# EAGLE design El-Fueradoro_Zuendbox_v2 (EAGLE 6.6.0)
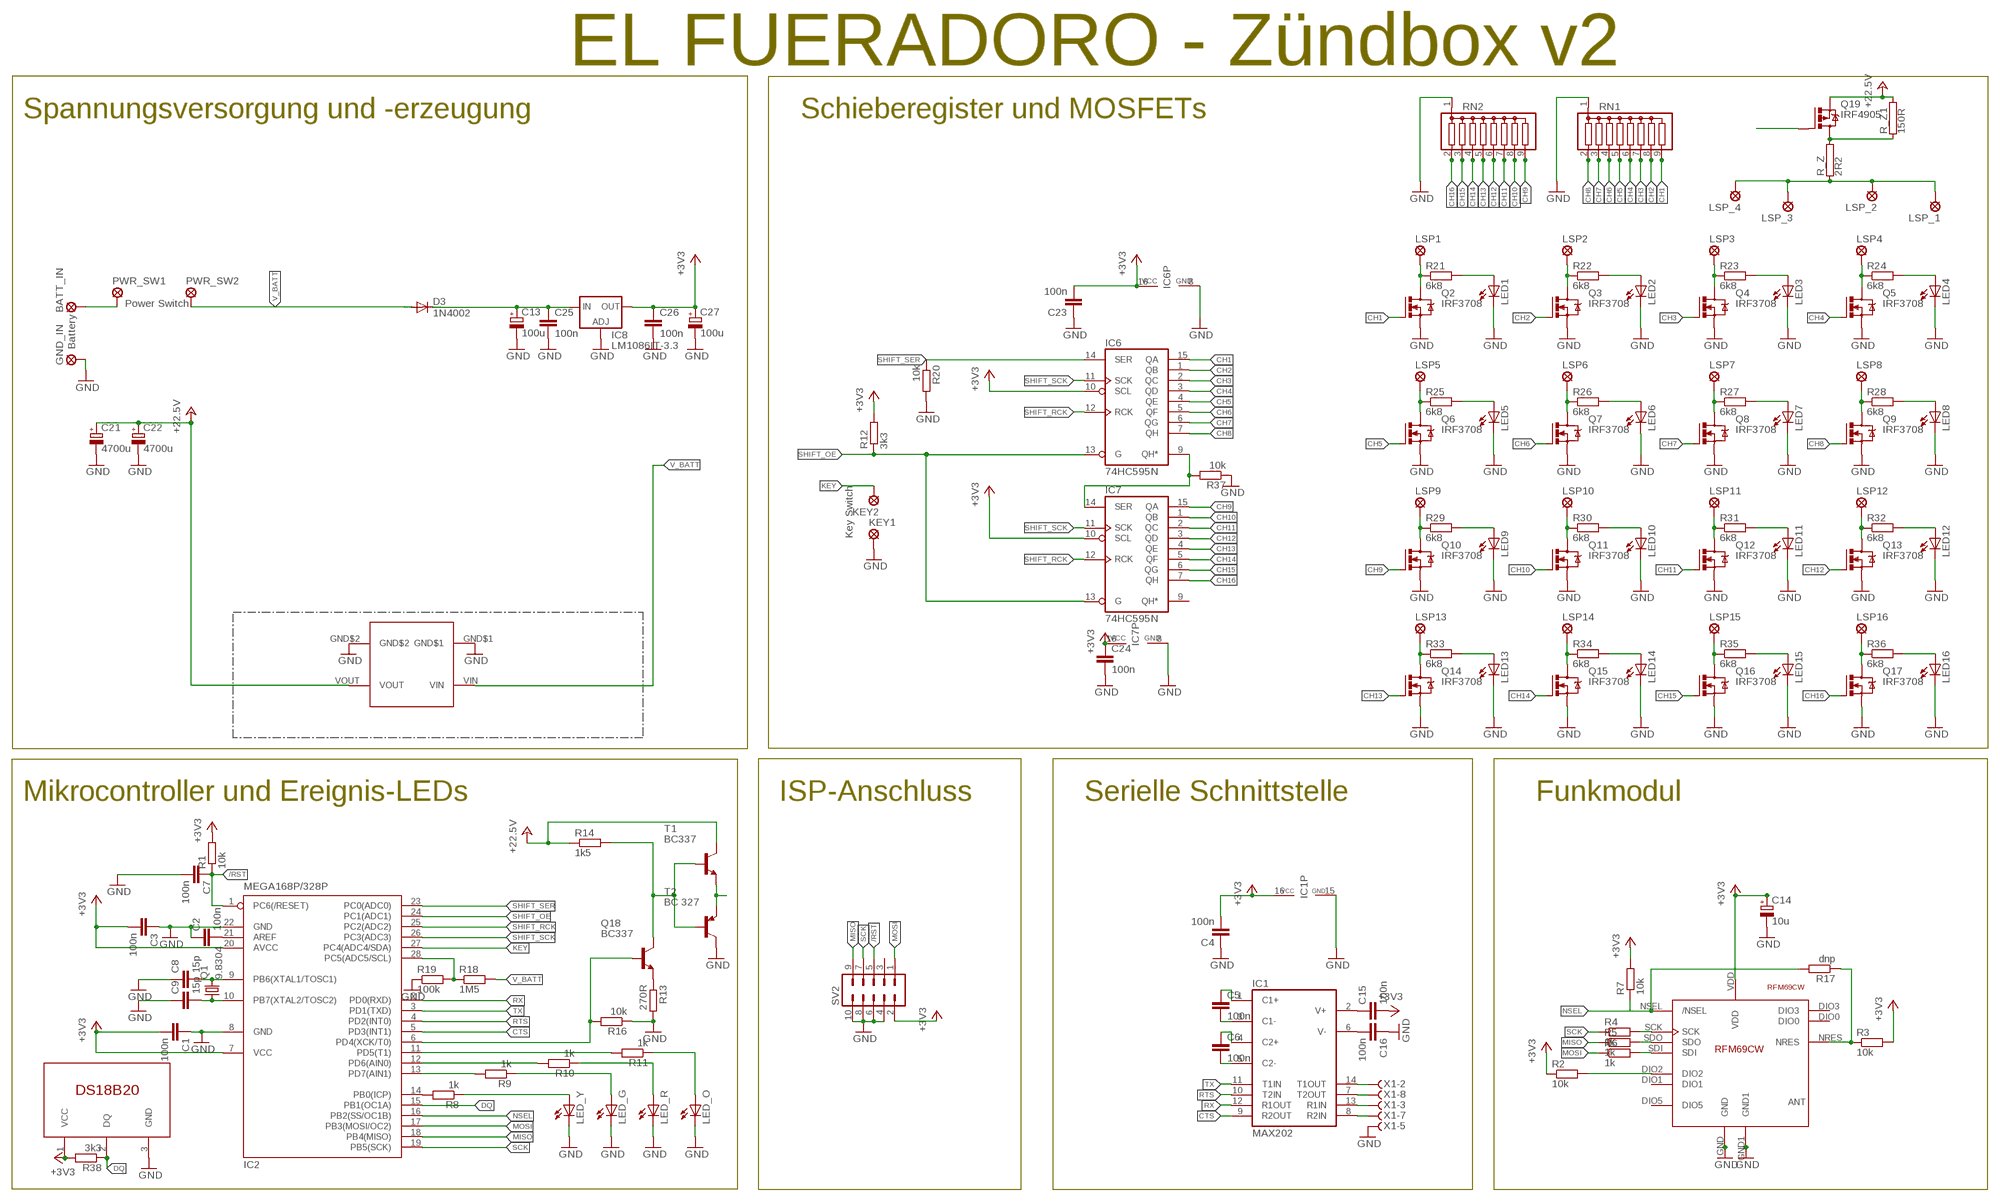
[diagram p0: schematic, sheet 1]

## Parts
BATT_IN  LSP10  [LSP10]
C1  100n  C-EU025-024X044  [C025-024X044]
C2  100n  C-EU025-024X044  [C025-024X044]
C3  100n  C-EU025-024X044  [C025-024X044]
C4  100n  C-EU025-024X044  [C025-024X044]
C5  100n  C-EU025-024X044  [C025-024X044]
C6  100n  C-EU025-024X044  [C025-024X044]
C7  100n  C-EU025-024X044  [C025-024X044]
C8  15p  C-EU025-024X044  [C025-024X044]
C9  15p  C-EU025-024X044  [C025-024X044]
C13  100u  CPOL-EUB45181A  [B45181A]
C14  10u  CPOL-EUB45181A  [B45181A]
C15  100n  C-EU025-024X044  [C025-024X044]
C16  100n  C-EU025-024X044  [C025-024X044]
C21  4700u  CPOL-EUE7.5-18  [E7,5-18]
C22  4700u  CPOL-EUE7.5-18  [E7,5-18]
C23  100n  C-EU025-024X044  [C025-024X044]
C24  100n  C-EU025-024X044  [C025-024X044]
C25  100n  C-EU025-024X044  [C025-024X044]
C26  100n  C-EU025-024X044  [C025-024X044]
C27  100u  CPOL-EUB45181A  [B45181A]
D3  1N4002  1N4004  [DO41-10]
GND_IN  LSP10  [LSP10]
IC1  MAX202  MAX232  [DIL16]
IC2  MEGA168P/328P  MEGA8-P  [DIL28-3]
IC6  74HC595N  [DIL16]
IC7  74HC595N  [DIL16]
IC8  LM1086IT-3.3  LD117AV  [TO220L1]
KEY1  LSP10  [LSP10]
KEY2  LSP10  [LSP10]
LED1  LED3MM  [LED3MM]
LED2  LED3MM  [LED3MM]
LED3  LED3MM  [LED3MM]
LED4  LED3MM  [LED3MM]
LED5  LED3MM  [LED3MM]
LED6  LED3MM  [LED3MM]
LED7  LED3MM  [LED3MM]
LED8  LED3MM  [LED3MM]
LED9  LED3MM  [LED3MM]
LED10  LED3MM  [LED3MM]
LED11  LED3MM  [LED3MM]
LED12  LED3MM  [LED3MM]
LED13  LED3MM  [LED3MM]
LED14  LED3MM  [LED3MM]
LED15  LED3MM  [LED3MM]
LED16  LED3MM  [LED3MM]
LED_G  LED5MM  [LED5MM]
LED_O  LED5MM  [LED5MM]
LED_R  LED5MM  [LED5MM]
LED_Y  LED5MM  [LED5MM]
LSP1  CH1  LSP11  [LSP11]
LSP2  CH2  LSP11  [LSP11]
LSP3  CH3  LSP11  [LSP11]
LSP4  CH4  LSP11  [LSP11]
LSP5  CH5  LSP11  [LSP11]
LSP6  CH6  LSP11  [LSP11]
LSP7  CH7  LSP11  [LSP11]
LSP8  CH8  LSP11  [LSP11]
LSP9  CH9  LSP11  [LSP11]
LSP10  CH10  LSP11  [LSP11]
LSP11  CH11  LSP11  [LSP11]
LSP12  CH12  LSP11  [LSP11]
LSP13  CH13  LSP11  [LSP11]
LSP14  CH14  LSP11  [LSP11]
LSP15  CH15  LSP11  [LSP11]
LSP16  CH16  LSP11  [LSP11]
LSP_1  LSP11  [LSP11]
LSP_2  LSP11  [LSP11]
LSP_3  LSP11  [LSP11]
LSP_4  LSP11  [LSP11]
PWR_SW1  LSP10  [LSP10]
PWR_SW2  LSP10  [LSP10]
Q1  9.8304  CRYSTALHC49S  [HC49/S]
Q2  IRF3708  IRF530  [TO220BV]
Q3  IRF3708  IRF530  [TO220BV]
Q4  IRF3708  IRF530  [TO220BV]
Q5  IRF3708  IRF530  [TO220BV]
Q6  IRF3708  IRF530  [TO220BV]
Q7  IRF3708  IRF530  [TO220BV]
Q8  IRF3708  IRF530  [TO220BV]
Q9  IRF3708  IRF530  [TO220BV]
Q10  IRF3708  IRF530  [TO220BV]
Q11  IRF3708  IRF530  [TO220BV]
Q12  IRF3708  IRF530  [TO220BV]
Q13  IRF3708  IRF530  [TO220BV]
Q14  IRF3708  IRF530  [TO220BV]
Q15  IRF3708  IRF530  [TO220BV]
Q16  IRF3708  IRF530  [TO220BV]
Q17  IRF3708  IRF530  [TO220BV]
Q18  BC337  BC337-40  [TO92]
Q19  IRF4905  IRF9530  [TO220BV]
R1  10k  R-EU_0207/10  [0207/10]
R2  10k  R-EU_0207/10  [0207/10]
R3  10k  R-EU_0207/10  [0207/10]
R4  1k  R-EU_0207/10  [0207/10]
R5  1k  R-EU_0207/10  [0207/10]
R6  1k  R-EU_0207/10  [0207/10]
R7  10k  R-EU_0207/10  [0207/10]
R8  1k  R-EU_0207/10  [0207/10]
R9  1k  R-EU_0207/10  [0207/10]
R10  1k  R-EU_0207/10  [0207/10]
R11  1k  R-EU_0207/10  [0207/10]
R12  3k3  R-EU_0207/10  [0207/10]
R13  270R  R-EU_0207/10  [0207/10]
R14  1k5  R-EU_0207/10  [0207/10]
R16  10k  R-EU_0207/10  [0207/10]
R17  dnp  R-EU_0207/10  [0207/10]
R18  1M5  R-EU_0207/10  [0207/10]
R19  100k  R-EU_0207/10  [0207/10]
R20  10k  R-EU_0207/10  [0207/10]
R21  6k8  R-EU_0207/10  [0207/10]
R22  6k8  R-EU_0207/10  [0207/10]
R23  6k8  R-EU_0207/10  [0207/10]
R24  6k8  R-EU_0207/10  [0207/10]
R25  6k8  R-EU_0207/10  [0207/10]
R26  6k8  R-EU_0207/10  [0207/10]
R27  6k8  R-EU_0207/10  [0207/10]
R28  6k8  R-EU_0207/10  [0207/10]
R29  6k8  R-EU_0207/10  [0207/10]
R30  6k8  R-EU_0207/10  [0207/10]
R31  6k8  R-EU_0207/10  [0207/10]
R32  6k8  R-EU_0207/10  [0207/10]
R33  6k8  R-EU_0207/10  [0207/10]
R34  6k8  R-EU_0207/10  [0207/10]
R35  6k8  R-EU_0207/10  [0207/10]
R36  6k8  R-EU_0207/10  [0207/10]
R37  10k  R-EU_0207/10  [0207/10]
R38  3k3  R-EU_0207/10  [0207/10]
R_Z  2R2  RKH214-8R  [KH214R-8]
R_Z1  150R  RKH214-8R  [KH214R-8]
RN1  G08R  [SIL9]
RN2  G08R  [SIL9]
SV2  ML10  [ML10]
T1  BC337  [TO92]
T2  BC 327  BC327  [TO92]
U$2  DS18B20  [TO92-LINE]
U$3  XL6009_MODULED  [XL6009_PACK]
U$4  RFM69CW  [RFM69CW]
X1  F09HPS  [F09HP]

## Nets
+3V3: C1.2 C3.2 C4.2 C14.+ C15.2 C23.2 C24.1 C26.1 C27.+ IC1.16(VCC) IC2.7(VCC) IC2.20(AVCC) IC6.10(SCL) IC6.16(VCC) IC7.10(SCL) IC7.16(VCC) IC8.2(OUT) R1.2 R2.1 R3.2 R7.2 R12.2 R38.2 SV2.2 U$2.1(VCC) U$4.VDD
+22_5V: C21.+ C22.+ Q19.S R14.1 R_Z1.2 T1.3(C) U$3.VOUT ; supply symbol labelled +22.5V
/RST: C7.1 IC2.1(PC6(/RESET)) R1.1 SV2.5
CH1: IC6.15(QA) Q2.G RN1.9
CH2: IC6.1(QB) Q3.G RN1.8
CH3: IC6.2(QC) Q4.G RN1.7
CH4: IC6.3(QD) Q5.G RN1.6
CH5: IC6.4(QE) Q6.G RN1.5
CH6: IC6.5(QF) Q7.G RN1.4
CH7: IC6.6(QG) Q8.G RN1.3
CH8: IC6.7(QH) Q9.G RN1.2
CH9: IC7.15(QA) Q10.G RN2.9
CH10: IC7.1(QB) Q11.G RN2.8
CH11: IC7.2(QC) Q12.G RN2.7
CH12: IC7.3(QD) Q13.G RN2.6
CH13: IC7.4(QE) Q14.G RN2.5
CH14: IC7.5(QF) Q15.G RN2.4
CH15: IC7.6(QG) Q16.G RN2.3
CH16: IC7.7(QH) Q17.G RN2.2
CTS: IC1.9(R2OUT) IC2.5(PD3(INT1))
DQ: IC2.15(PB1(OC1A)) R38.1 U$2.2(DQ)
DRVBASE: Q18.3(C) R14.2 T1.2(B) T2.2(B)
GND: C1.1 C2.1 C3.1 C4.1 C7.2 C8.1 C9.1 C13.- C14.- C16.1 C21.- C22.- C23.1 C24.2 C25.2 C26.2 C27.- GND_IN.MP IC1.15(GND) IC2.8(GND) IC2.22(GND) IC6.8(GND) IC7.8(GND) IC8.1(ADJ) KEY1.MP LED1.K(C) LED2.K(C) LED3.K(C) LED4.K(C) LED5.K(C) LED6.K(C) LED7.K(C) LED8.K(C) LED9.K(C) LED10.K(C) LED11.K(C) LED12.K(C) LED13.K(C) LED14.K(C) LED15.K(C) LED16.K(C) LED_G.K(C) LED_O.K(C) LED_R.K(C) LED_Y.K(C) Q2.S Q3.S Q4.S Q5.S Q6.S Q7.S Q8.S Q9.S Q10.S Q11.S Q12.S Q13.S Q14.S Q15.S Q16.S Q17.S R13.2 R16.1 R19.1 R20.2 R37.1 RN1.1 RN2.1 SV2.4 SV2.6 SV2.8 SV2.10 T2.3(C) U$2.3(GND) U$3.GND$1 U$3.GND$2 U$4.GND U$4.GND1 X1.5(-5:F)
KEY: IC2.27(PC4(ADC4/SDA)) KEY2.MP
MISO: IC2.18(PB4(MISO)) R5.1 SV2.9
MOSI: IC2.17(PB3(MOSI/OC2)) R6.1 SV2.1
N$1: BATT_IN.MP PWR_SW1.MP
N$2: C13.+ C25.1 D3.C IC8.3(IN)
N$3: IC2.6(PD4(XCK/T0)) Q18.2(B) R16.2
N$4: Q18.1(E) R13.1
N$7: LSP_1.MP LSP_2.MP LSP_3.MP LSP_4.MP R_Z.1
N$8: Q19.D R_Z1.1 R_Z.2
N$9: R2.2 U$4.DIO2
N$10: R4.2 U$4.SCK
N$11: R5.2 U$4.SDO
N$12: R6.2 U$4.SDI
N$13: R3.1 R17.1 U$4.NRES
N$17: C2.2 IC2.21(AREF)
N$18: C9.2 IC2.10(PB7(XTAL2/TOSC2)) Q1.1
N$19: C5.1 IC1.1(C1+)
N$20: C5.2 IC1.3(C1-)
N$21: C6.1 IC1.4(C2+)
N$22: C6.2 IC1.5(C2-)
N$23: C8.2 IC2.9(PB6(XTAL1/TOSC1)) Q1.2
N$27: IC2.13(PD7(AIN1)) R9.2
N$28: IC2.12(PD6(AIN0)) R10.2
N$29: IC2.11(PD5(T1)) R11.2
N$30: LED_O.A R11.1
N$31: IC2.14(PB0(ICP)) R8.2
N$32: LED_R.A R10.1
N$33: LED_G.A R9.1
N$34: LED_Y.A R8.1
N$37: IC2.28(PC5(ADC5/SCL)) R18.1 R19.2
N$43: C15.1 IC1.2(V+)
N$44: C16.2 IC1.6(V-)
N$51: IC6.9(QH*) IC7.14(SER) R37.2
N$52: LSP1.MP Q2.D R21.1
N$53: LSP2.MP Q3.D R22.1
N$54: LSP3.MP Q4.D R23.1
N$55: LSP4.MP Q5.D R24.1
N$56: LSP5.MP Q6.D R25.1
N$57: LSP6.MP Q7.D R26.1
N$58: LSP7.MP Q8.D R27.1
N$59: LSP8.MP Q9.D R28.1
N$60: LSP9.MP Q10.D R29.1
N$61: LSP10.MP Q11.D R30.1
N$62: LSP11.MP Q12.D R31.1
N$63: LSP12.MP Q13.D R32.1
N$64: LSP13.MP Q14.D R33.1
N$65: LSP14.MP Q15.D R34.1
N$66: LSP15.MP Q16.D R35.1
N$67: LSP16.MP Q17.D R36.1
N$72: LED1.A R21.2
N$73: LED2.A R22.2
N$74: LED3.A R23.2
N$75: LED4.A R24.2
N$76: LED5.A R25.2
N$77: LED6.A R26.2
N$78: LED7.A R27.2
N$79: LED8.A R28.2
N$80: LED9.A R29.2
N$81: LED10.A R30.2
N$82: LED11.A R31.2
N$83: LED12.A R32.2
N$84: LED13.A R33.2
N$85: LED14.A R34.2
N$86: LED15.A R35.2
N$87: LED16.A R36.2
NSEL: IC2.16(PB2(SS/OC1B)) R7.1 R17.2 U$4.NSEL(/NSEL)
PC_CTS_IN: IC1.7(T2OUT) X1.8(-8:F)
PC_RTS_OUT: IC1.8(R2IN) X1.7(-7:F)
PC_RX_IN: IC1.14(T1OUT) X1.2(-2:F)
PC_TX_OUT: IC1.13(R1IN) X1.3(-3:F)
PMOSG: Q19.G T1.1(E) T2.1(E)
RTS: IC1.10(T2IN) IC2.4(PD2(INT0))
RX: IC1.12(R1OUT) IC2.2(PD0(RXD))
SCK: IC2.19(PB5(SCK)) R4.1 SV2.7
SHIFT_OE: IC2.24(PC1(ADC1)) IC6.13(G) IC7.13(G) R12.1
SHIFT_RCK: IC2.25(PC2(ADC2)) IC6.12(RCK) IC7.12(RCK)
SHIFT_SCK: IC2.26(PC3(ADC3)) IC6.11(SCK) IC7.11(SCK)
SHIFT_SER: IC2.23(PC0(ADC0)) IC6.14(SER) R20.1
TX: IC1.11(T1IN) IC2.3(PD1(TXD))
V_BATT: D3.A PWR_SW2.MP R18.2 U$3.VIN
Unconnected: IC7.9(QH*) SV2.3 U$4.DIO0 U$4.DIO1 U$4.DIO3 U$4.DIO5 X1.1(-1:F) X1.4(-4:F) X1.6(-6:F) X1.9(-9:F) X1.G1(-G:G1) X1.G2(-G:G2)

## Notes on the sheet
- EL FUERADORO - Zündbox v2
- Spannungsversorgung und -erzeugung | Schieberegister und MOSFETs
- Power Switch
- Battery
- Key Switch
- Mikrocontroller und Ereignis-LEDs | ISP-Anschluss | Serielle Schnittstelle | Funkmodul

## Library data of the parts
BATT_IN GND_IN KEY1 KEY2 PWR_SW1 PWR_SW2 = solpad:LSP10: SOLDER PAD drill 1.0 mm, distributor Buerklin, 12H555
C1-C9 C15 C16 C23-C26 = rcl:C-EU: CAPACITOR, European symbol
C13 C14 C21 C22 C27 = rcl:CPOL-EU: POLARIZED CAPACITOR, European symbol
D3 = diode:1N4004: DIODE general purpose rectifier, 1 A
IC1 = maxim:MAX232: RS232 TRANSCEIVER; MF: MAXIM; MPN: MAX232ACPE+; OC_FARNELL: 9723773; OC_NEWARK: 68K4544
IC2 = atmel:MEGA8-P: MICROCONTROLLER 8 Kbytes FLASH, 1 kbytes SRAM, 512 bytes EEPROM, USART, 4-channel 10 bit ADC, 2-channel 8 bit ADC Pin compatible with Atmega48, ATMega88, ATMega168 Source: avr.lbr; OC_FARNELL: unknown; OC_NEWARK: unknown
IC6 IC7 = 74xx-eu:74*595: 8-bit SHIFT REGISTER, output latch
IC8 = v-reg:LD117A?*: Low drop fixed and adjustable positive voltage regulators 1 A Source: http://www.st.com/stonline/products/literature/ds/7194/ld1117axx.pdf
LED1-LED16 LED_G LED_O LED_R LED_Y = led:LED: LED OSRAM: - CHIPLED LG R971, LG N971, LY N971, LG Q971, LY Q971, LO R971, LY R971 LH N974, LH R974 LS Q976, LO Q976, LY Q976 LO Q996 - Hyper CHIPLED LW Q18S LB Q993, LB Q99A, LB R99A - SideLED LS A670, LO A670, LY A670, LG A670, LP A670 LB A673, LV A673, LT A673, LW A673 LH A674 LY A675 LS A676, LA A676, LO A676, LY A676, LW A676 LS A679, LY A679, LG A679 - Hyper Micro SIDELED® LS Y876, LA Y876, LO Y876, LY Y876 LT Y87S - SmartLED LW L88C, LW L88S LB L89C, LB L89S, LG L890 LS L89K, LO L89K, LY L89K LS L896, LA L896, LO L896, LY L896 - TOPLED LS T670, LO T670, LY T670, LG T670, LP T670 LSG T670, LSP T670, LSY T670, LOP T670, LYG T670 LG T671, LOG T671, LSG T671 LB T673, LV T673, LT T673, LW T673 LH T674 LS T676, LA T676, LO T676, LY T676, LB T676, LH T676, LSB T676, LW T676 LB T67C, LV T67C, LT T67C, LS T67K, LO T67K, LY T67K, LW E67C LS E67B, LA E67B, LO E67B, LY E67B, LB E67C, LV E67C, LT E67C LW T67C LS T679, LY T679, LG T679 LS T770, LO T770, LY T770, LG T770, LP T770 LB T773, LV T773, LT T773, LW T773 LH T774 LS E675, LA E675, LY E675, LS T675 LS T776, LA T776, LO T776, LY T776, LB T776 LHGB T686 LT T68C, LB T68C - Hyper Mini TOPLED® LB M676 - Mini TOPLED Santana® LG M470 LS M47K, LO M47K, LY M47K Source: http://www.osram.convergy.de LUXEON: - LUMILED® LXK2-PW12-R00, LXK2-PW12-S00, LXK2-PW14-U00, LXK2-PW14-V00 LXK2-PM12-R00, LXK2-PM12-S00, LXK2-PM14-U00 LXK2-PE12-Q00, LXK2-PE12-R00, LXK2-PE12-S00, LXK2-PE14-T00, LXK2-PE14-U00 LXK2-PB12-K00, LXK2-PB12-L00, LXK2-PB12-M00, LXK2-PB14-N00, LXK2-PB14-P00, LXK2-PB14-Q00 LXK2-PR12-L00, LXK2-PR12-M00, LXK2-PR14-Q00, LXK2-PR14-R00 LXK2-PD12-Q00, LXK2-PD12-R00, LXK2-PD12-S00 LXK2-PH12-R00, LXK2-PH12-S00 LXK2-PL12-P00, LXK2-PL12-Q00, LXK2-PL12-R00 Source: www.luxeon.com KINGBRIGHT: KA-3528ASYC Source: www.kingbright.com
LSP1-LSP16 LSP_1-LSP_4 = solpad:LSP11: SOLDER PAD drill 1.1 mm
Q1 = crystal:CRYSTAL: CRYSTAL; OC_FARNELL: 1667008; OC_NEWARK: unknown
Q2-Q17 = transistor-power:IRF530: HEXFET Power MOSFET
Q18 = transistor-npn:BC337*: NPN Transistor
Q19 = transistor-power:IRF9530: P-CHANNEL HEXFET POWER-MOS-FET Source: http://www.irf.com/product-info/datasheets/data/irf9530.pdf
R1-R14 R16-R38 = rcl:R-EU_: RESISTOR, European symbol
R_Z R_Z1 = resistor-power:R: Power Resitor; OC_FARNELL: unknown; OC_NEWARK: unknown
RN1 RN2 = resistor-sil:G08R: SIL RESISTOR; OC_FARNELL: unknown; OC_NEWARK: unknown
SV2 = fp:ML10: HARTING; OC_FARNELL: unknown; OC_NEWARK: unknown
T1 = transistor:BC337: NPN TRANSISTOR
T2 = transistor-pnp:BC327: PNP Transistor
U$2 = fp:DS18B20
U$3 = fp:XL6009_MODULE
U$4 = fp:RFM69CW
X1 = fp:F09HPS: SUB-D; OC_FARNELL: unknown; OC_NEWARK: unknown

## Board
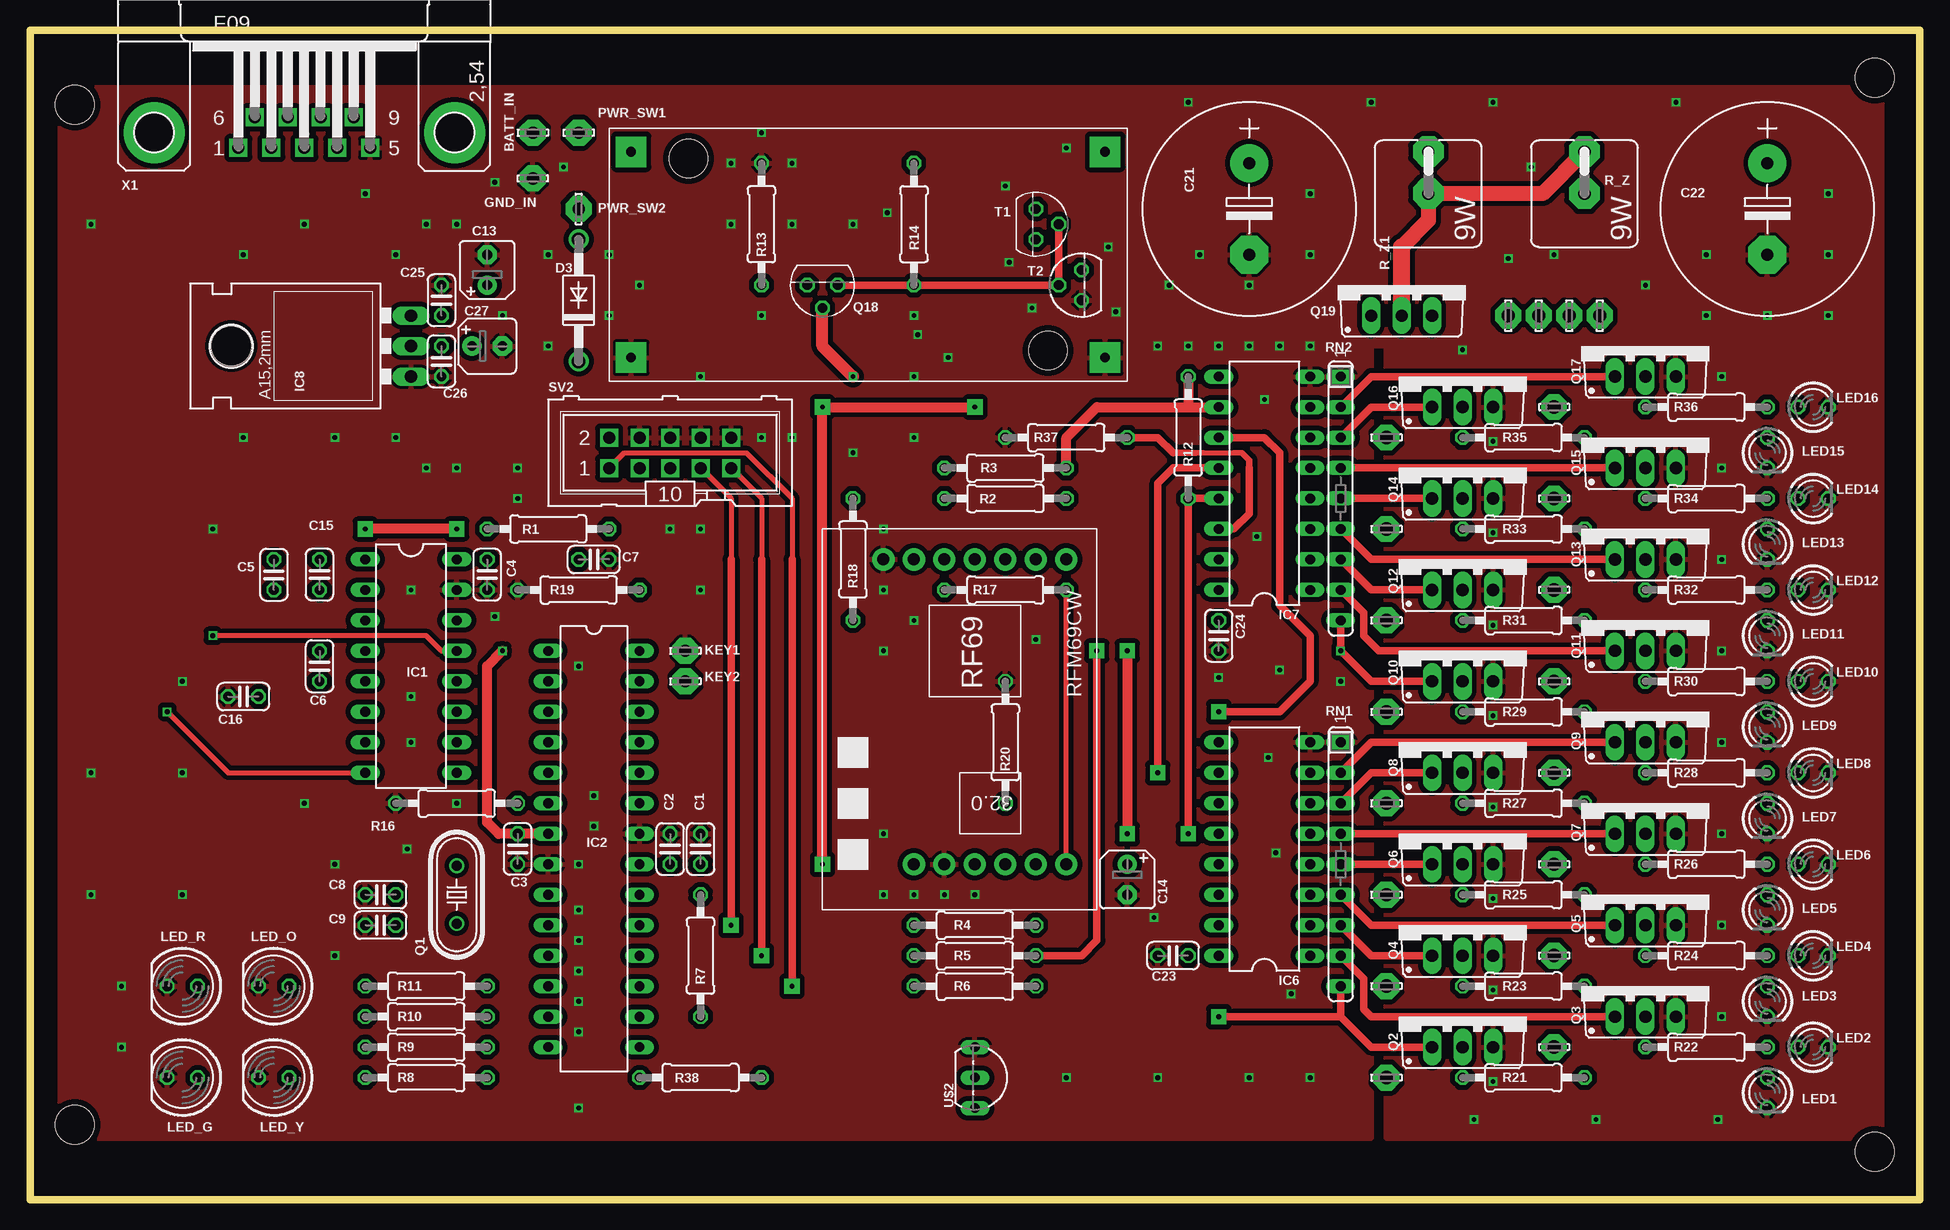
[diagram p1: board, top side]
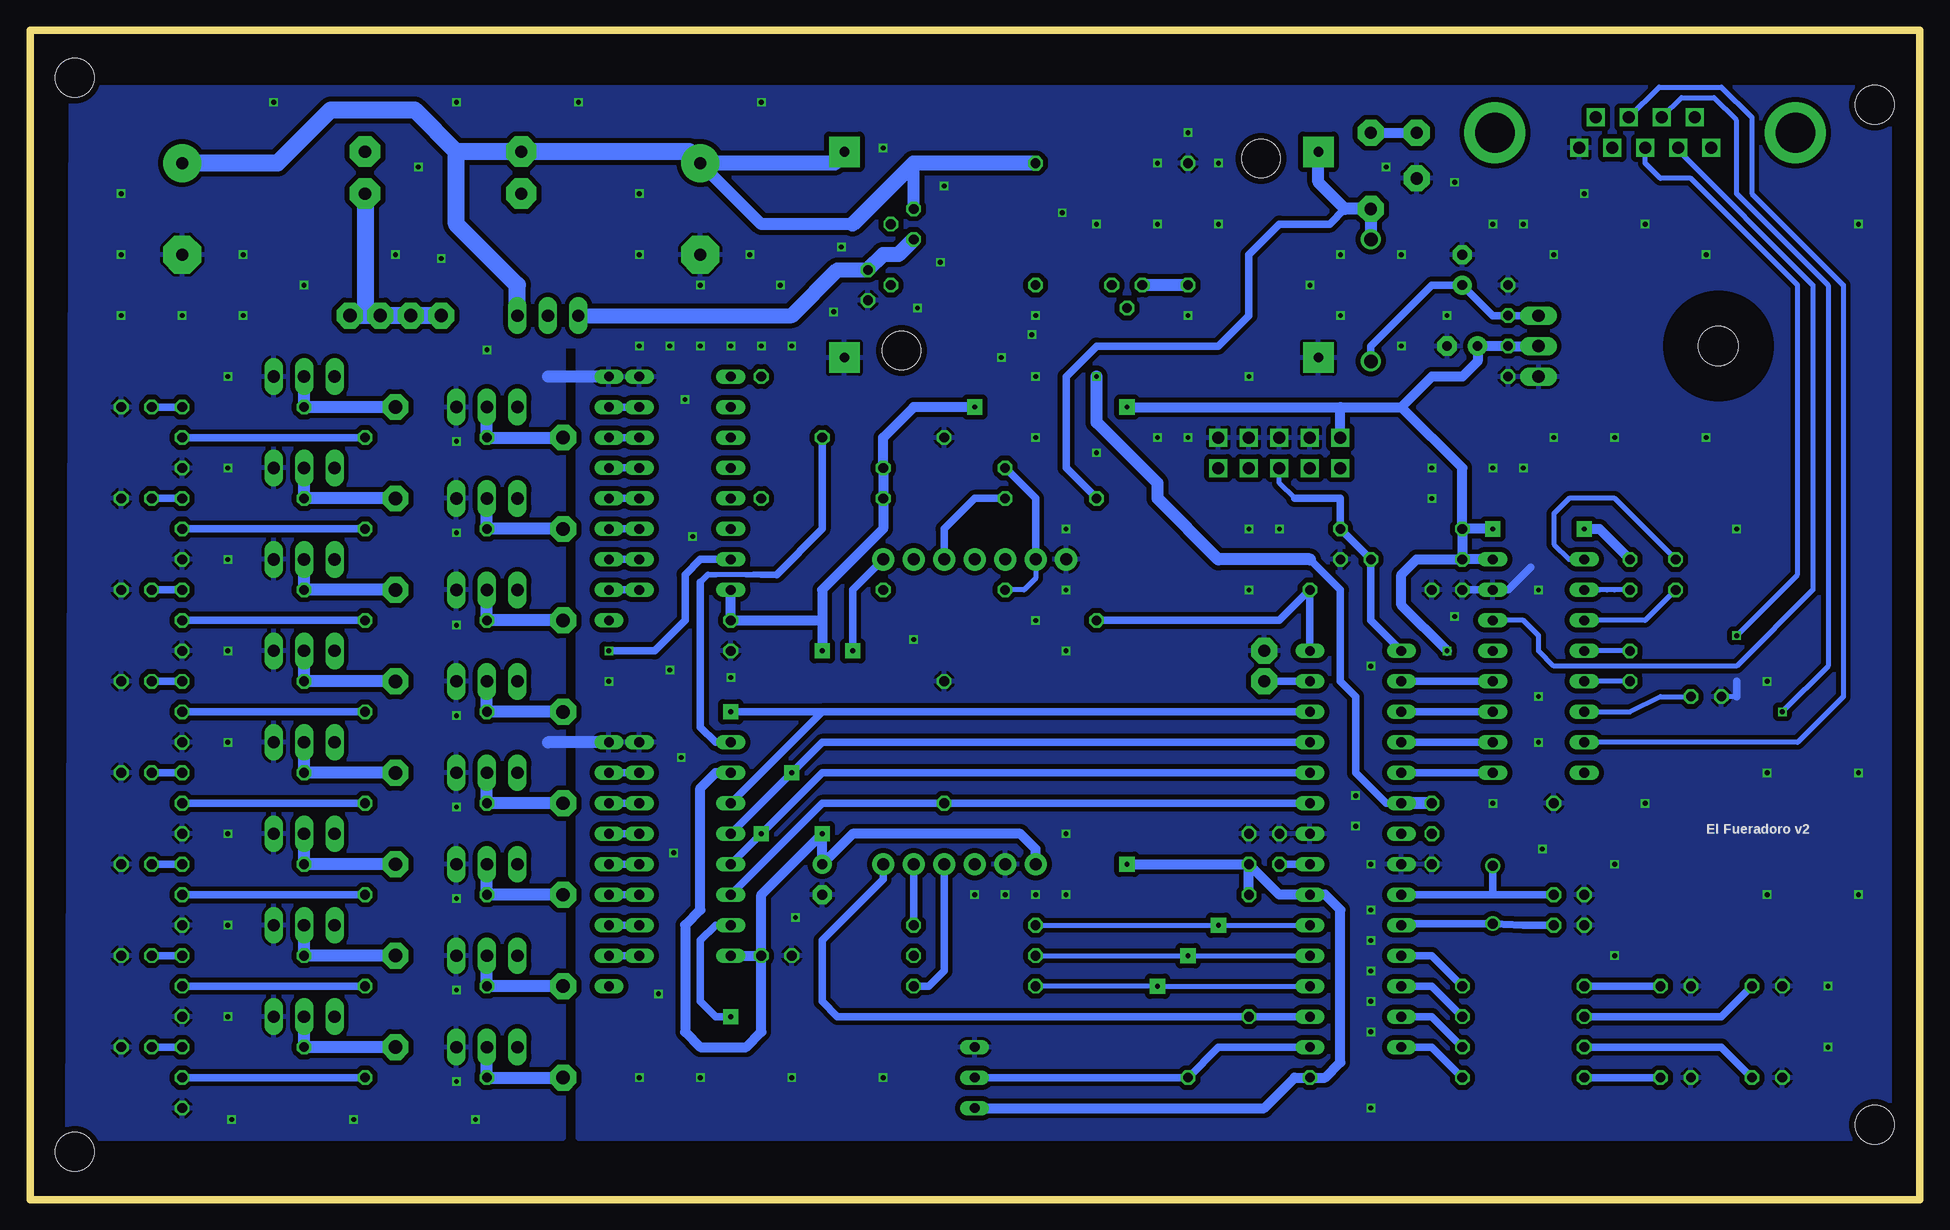
[diagram p2: board, bottom side, seen from below]

Size 157.46 x 97.46 mm. Coordinates in mm from the lower left corner, seen from the top.
Outline: 0,97.46 0,0 157.46,0 157.46,97.46 0,97.46
Copper layers (1*16): Top 0.035mm / dielectric 1.6mm / Bottom 0.035mm
Design rules "Elecrow_2-layer_PCB_eagle_rule": minimum track width 6mil, minimum drill 12mil, track to track 6mil, track to pad 6mil, pad to pad 6mil, via to via 8mil, smd to smd 0mil, copper to edge 20mil, drill to drill 10mil, minimum pad ring 6mil, minimum via ring 6mil, stop-mask expansion 0mil, vias tented up to drill 100mil, thermal gap 10mil
Holes 3.2 mm at 3.73,6.23 3.73,91.23 153.73,3.98 153.73,93.48

### Footprints (pad centres in the part's own frame; a part is rotated, then mirrored left to right if it is on the bottom)
LSP10 = drill 1.016 pad 2.159 octagon: MP 0,0
C025-024X044 = drill 0.813 octagon: 1 -1.27,0; 2 1.27,0
B45181A = drill 0.813 pad 1.6: + -1.27,0 | drill 0.813 pad 1.6 octagon: - 1.27,0
E7,5-18 = drill 1.016 pad 3.15: + -3.81,0 | drill 1.016 pad 3.15 octagon: - 3.81,0
DO41-10 = drill 1.118: A 5.08,0; C -5.08,0
DIL16 = drill 0.813 long: 1 -8.89,-3.81; 2 -6.35,-3.81; 3 -3.81,-3.81; 4 -1.27,-3.81; 5 1.27,-3.81; 6 3.81,-3.81; 7 6.35,-3.81; 8 8.89,-3.81; 9 8.89,3.81; 10 6.35,3.81; 11 3.81,3.81; 12 1.27,3.81; 13 -1.27,3.81; 14 -3.81,3.81; 15 -6.35,3.81; 16 -8.89,3.81
DIL28-3 = drill 0.813 long: 1 -16.51,-3.81; 2 -13.97,-3.81; 3 -11.43,-3.81; 4 -8.89,-3.81; 5 -6.35,-3.81; 6 -3.81,-3.81; 7 -1.27,-3.81; 8 1.27,-3.81; 9 3.81,-3.81; 10 6.35,-3.81; 11 8.89,-3.81; 12 11.43,-3.81; 13 13.97,-3.81; 14 16.51,-3.81; 15 16.51,3.81; 16 13.97,3.81; 17 11.43,3.81; 18 8.89,3.81; 19 6.35,3.81; 20 3.81,3.81; 21 1.27,3.81; 22 -1.27,3.81; 23 -3.81,3.81; 24 -6.35,3.81; 25 -8.89,3.81; 26 -11.43,3.81; 27 -13.97,3.81; 28 -16.51,3.81
TO220L1 = drill 1.016 long: 1 -2.54,-3.81; 2 0,-3.81; 3 2.54,-3.81 | hole 3.302: 0,11.176
LED3MM = drill 0.813 octagon: A -1.27,0; K 1.27,0
LED5MM = drill 0.813 octagon: A -1.27,0; K 1.27,0
LSP11 = drill 1.118 pad 2.159 octagon: MP 0,0
HC49/S = drill 0.813: 1 -2.413,0; 2 2.413,0
TO220BV = drill 1.016 long: D 0,-2.54; G -2.54,-2.54; S 2.54,-2.54
TO92 = drill 0.813 octagon: 1 1.27,0; 2 0,1.905; 3 -1.27,0
0207/10 = drill 0.813 octagon: 1 -5.08,0; 2 5.08,0
KH214R-8 = drill 1.016 pad 2.54 octagon: 1 0,0; 2 3.5,0
SIL9 = drill 0.813 long: 1 -10.16,0; 2 -7.62,0; 3 -5.08,0; 4 -2.54,0; 5 0,0; 6 2.54,0; 7 5.08,0; 8 7.62,0; 9 10.16,0
ML10 = drill 1 pad 1.5 square: 1 -5.08,-1.27; 2 -5.08,1.27; 3 -2.54,-1.27; 4 -2.54,1.27; 5 0,-1.27; 6 0,1.27; 7 2.54,-1.27; 8 2.54,1.27; 9 5.08,-1.27; 10 5.08,1.27
TO92-LINE = drill 0.813 long: 1 -2.54,1.27; 2 0,1.27; 3 2.54,1.27
XL6009_PACK = drill 0.8 pad 2.54 square: GND$1 -19.75,-8.573; GND$2 19.75,-8.573; VIN -19.75,8.573; VOUT 19.75,8.573 | hole 3.2: -14.986,8.001; 14.986,-8.001
RFM69CW = drill 1 pad 1.85: DIO0 -12.7,5.08; DIO1 -12.7,0; DIO2 -12.7,2.54; DIO3 12.7,0; DIO5 -12.7,-2.54; GND -12.7,-7.62; GND1 12.7,-2.54; NRES -12.7,-5.08; NSEL 12.7,7.62; SCK 12.7,5.08; SDI 12.7,2.54; SDO -12.7,7.62; VDD 12.7,-5.08
F09HP = drill 1 pad 1.5 square: 1 -5.486,-1.27; 2 -2.743,-1.27; 3 0,-1.27; 4 2.743,-1.27; 5 5.486,-1.27; 6 -4.115,1.27; 7 -1.372,1.27; 8 1.372,1.27; 9 4.115,1.27 | drill 3.302 pad 5.08: G1 -12.522,0; G2 12.522,0

### Placement (x,y rotation side)
BATT_IN  41.91,88.9 0 top
C1  55.88,29.21 270 top
C2  53.34,29.21 270 top
C3  40.64,29.21 90 top
C4  38.1,52.07 90 top
C5  20.32,52.07 270 top
C6  24.13,44.45 270 top
C7  46.99,53.34 0 top
C8  29.21,25.4 0 top
C9  29.21,22.86 0 top
C13  38.1,77.47 90 top
C14  91.44,26.67 270 top
C15  24.13,52.07 90 top
C16  17.78,41.91 0 top
C21  101.6,82.55 270 top
C22  144.78,82.55 270 top
C23  95.25,20.32 0 top
C24  99.06,46.99 270 top
C25  34.29,74.93 90 top
C26  34.29,69.85 270 top
C27  38.1,71.12 0 top
D3  45.72,74.93 90 top
GND_IN  41.91,85.09 180 top
IC1  31.75,44.45 270 top
IC2  46.99,29.21 270 top
IC6  102.87,29.21 90 top
IC7  102.87,59.69 90 top
IC8  27.94,71.12 90 top
KEY1  54.61,45.72 0 top
KEY2  54.61,43.18 0 top
LED1  144.78,8.89 270 top
LED2  148.59,12.7 0 top
LED3  144.78,16.51 270 top
LED4  148.59,20.32 0 top
LED5  144.78,24.13 270 top
LED6  148.59,27.94 0 top
LED7  144.78,31.75 270 top
LED8  148.59,35.56 0 top
LED9  144.78,39.37 270 top
LED10  148.59,43.18 0 top
LED11  144.78,46.99 270 top
LED12  148.59,50.8 0 top
LED13  144.78,54.61 270 top
LED14  148.59,58.42 0 top
LED15  144.78,62.23 270 top
LED16  148.59,66.04 0 top
LED_G  12.7,10.16 180 top
LED_O  20.32,17.78 180 top
LED_R  12.7,17.78 180 top
LED_Y  20.32,10.16 180 top
LSP1  113.03,10.16 0 top
LSP2  127,12.7 0 top
LSP3  113.03,17.78 0 top
LSP4  127,20.32 0 top
LSP5  113.03,25.4 0 top
LSP6  127,27.94 0 top
LSP7  113.03,33.02 0 top
LSP8  127,35.56 0 top
LSP9  113.03,40.64 0 top
LSP10  127,43.18 0 top
LSP11  113.03,48.26 0 top
LSP12  127,50.8 0 top
LSP13  113.03,55.88 0 top
LSP14  127,58.42 0 top
LSP15  113.03,63.5 0 top
LSP16  127,66.04 0 top
LSP_1  123.19,73.66 90 top
LSP_2  125.73,73.66 90 top
LSP_3  128.27,73.66 90 top
LSP_4  130.81,73.66 90 top
PWR_SW1  45.72,88.9 0 top
PWR_SW2  45.72,82.55 90 top
Q1  35.56,25.4 90 top
Q2  119.38,15.24 0 top
Q3  134.62,17.78 0 top
Q4  119.38,22.86 0 top
Q5  134.62,25.4 0 top
Q6  119.38,30.48 0 top
Q7  134.62,33.02 0 top
Q8  119.38,38.1 0 top
Q9  134.62,40.64 0 top
Q10  119.38,45.72 0 top
Q11  134.62,48.26 0 top
Q12  119.38,53.34 0 top
Q13  134.62,55.88 0 top
Q14  119.38,60.96 0 top
Q15  134.62,63.5 0 top
Q16  119.38,68.58 0 top
Q17  134.62,71.12 0 top
Q18  66.04,76.2 180 top
Q19  114.3,76.2 0 top
R1  43.18,55.88 180 top
R2  81.28,58.42 180 top
R3  81.28,60.96 0 top
R4  78.74,22.86 0 top
R5  78.74,20.32 0 top
R6  78.74,17.78 0 top
R7  55.88,20.32 90 top
R8  33.02,10.16 0 top
R9  33.02,12.7 0 top
R10  33.02,15.24 0 top
R11  33.02,17.78 0 top
R12  96.52,63.5 90 top
R13  60.96,81.28 90 top
R14  73.66,81.28 270 top
R16  35.56,33.02 0 top
R17  81.28,50.8 0 top
R18  68.58,53.34 90 top
R19  45.72,50.8 0 top
R20  81.28,38.1 90 top
R21  124.46,10.16 0 top
R22  139.7,12.7 0 top
R23  124.46,17.78 0 top
R24  139.7,20.32 0 top
R25  124.46,25.4 0 top
R26  139.7,27.94 0 top
R27  124.46,33.02 0 top
R28  139.7,35.56 0 top
R29  124.46,40.64 0 top
R30  139.7,43.18 0 top
R31  124.46,48.26 0 top
R32  139.7,50.8 0 top
R33  124.46,55.88 0 top
R34  139.7,58.42 0 top
R35  124.46,63.5 0 top
R36  139.7,66.04 0 top
R37  86.36,63.5 0 top
R38  55.88,10.16 180 top
R_Z  129.54,83.82 90 top
R_Z1  116.52,83.82 90 top
RN1  109.22,27.94 270 top
RN2  109.22,58.42 270 top
SV2  53.34,62.23 0 top
T1  83.82,81.28 270 top
T2  87.63,76.2 90 top
U$2  80.01,10.16 90 top
U$3  69.85,78.74 0 top
U$4  78.74,40.64 270 top
X1  22.86,88.9 0 top

### Tracks (layer width: path | path; a pad name or v marks a point on that pad's centre or on a via)
+3V3  (via drill 0.4 pad 0.5, 0.4 pad 1.27)
  Top 0.813: v35.56,55.88 v27.94,55.88 | v91.44,45.72 v91.44,30.48 | R3.2 86.36,63.5 88.9,66.04 96.52,66.04 | 96.52,66.04 IC7.10 | R12.2 96.52,66.04 | v66.04,27.94 v66.04,66.04 v78.74,66.04 | IC2.7 C3.2 39.05,30.48 38.1,31.43 38.1,44.45 v39.37,45.72
  Bottom 0.813: IC1.16 C4.2 | v27.94,55.88 26.67,55.88 C15.2 | 91.44,48.26 91.44,50.8 86.36,55.88 R2.1 R3.2 86.36,63.5 83.82,66.04 v78.74,66.04 | 91.44,48.26 v91.44,45.72 | R7.2 C1.2 | U$4.VDD 73.66,29.21 74.93,30.48 88.9,30.48 C14.+ v91.44,30.48 96.52,25.4 C23.2 | R1.2 C4.2 | U$2.1 54.61,7.62 52.07,10.16 R38.2 49.53,10.16 48.26,11.43 48.26,24.13 49.53,25.4 IC2.20 53.34,25.4 C1.2 | IC6.16 C23.2 | IC6.10 100.33,35.56 101.6,34.29 101.6,24.13 102.87,22.86 102.87,13.97 101.6,12.7 97.79,12.7 96.52,13.97 C23.2 | IC8.2 C26.1 C27.+ 36.83,69.85 38.1,68.58 40.64,68.58 43.18,66.04 | IC7.16 C24.1 91.44,48.26 | v66.04,66.04 48.26,66.04 | 48.26,66.04 43.18,66.04 | v35.56,55.88 R1.2 | R1.2 38.1,60.96 43.18,66.04 | v66.04,27.94 C1.2 | SV2.2 48.26,66.04 | v39.37,45.72 43.18,49.53 43.18,52.07 41.91,53.34 C4.2
+22_5V
  Bottom 1.016: 88.9,81.28 96.52,81.28 C21.+ | T1.3 83.82,86.36
  Bottom 1.27: C21.+ 90.42,86.36 U$3.VOUT | R14.1 83.82,86.36 88.9,81.28
  Bottom 1.422: C22.+ 136.84,86.36 132.4,90.81 125.41,90.81 121.92,87.31 | Q19.S 116.84,76.2 121.92,81.28 121.92,87.31 | C21.+ 102.56,87.32 R_Z1.2 121.92,87.32 121.92,87.31
/RST
  Bottom 0.406: 52.07,58.42 53.34,59.69 SV2.5
  Bottom 0.61: 52.07,58.42 50.8,58.42 48.26,58.42 R1.1 C7.1 45.72,48.26 IC2.1
CH1  (via drill 0.4 pad 1.27)
  Top 0.61: v99.06,15.24 109.22,15.24 | 109.22,15.24 111.76,12.7 Q2.G | RN1.9 109.22,15.24
  Bottom 0.61: v99.06,15.24 100.33,15.24 101.6,16.51 101.6,21.59 100.33,22.86 IC6.15
CH2
  Top 0.61: RN1.8 111.12,18.41 111.12,15.88 111.76,15.24 Q3.G
  Bottom 0.61: IC6.1 RN1.8
CH3
  Top 0.61: Q4.G 111.76,20.32 RN1.7
  Bottom 0.61: RN1.7 IC6.2
CH4
  Top 0.61: RN1.6 111.76,22.86 Q5.G
  Bottom 0.61: IC6.3 RN1.6
CH5
  Top 0.61: RN1.5 Q6.G
  Bottom 0.61: RN1.5 IC6.4
CH6
  Top 0.61: RN1.4 Q7.G
  Bottom 0.61: IC6.5 RN1.4
CH7
  Top 0.61: RN1.3 111.76,35.56 Q8.G
  Bottom 0.61: IC6.6 RN1.3
CH8
  Top 0.61: RN1.2 111.76,38.1 Q9.G
  Bottom 0.61: IC6.7 RN1.2
CH9  (via drill 0.4)
  Top 0.61: Q10.G 111.76,43.18 v109.22,45.72 RN2.9
  Bottom 0.61: IC7.15 101.6,53.34 102.87,52.07 102.87,48.26 105.41,45.72 v109.22,45.72
CH10
  Top 0.61: RN2.8 111.12,48.9 111.12,46.99 112.39,45.72 Q11.G
  Bottom 0.61: IC7.1 RN2.8
CH11
  Top 0.61: RN2.7 111.76,50.8 Q12.G
  Bottom 0.61: IC7.2 RN2.7
CH12
  Top 0.61: RN2.6 111.76,53.34 Q13.G
  Bottom 0.61: IC7.3 RN2.6
CH13
  Top 0.61: RN2.5 Q14.G
  Bottom 0.61: IC7.4 RN2.5
CH14
  Top 0.61: RN2.4 Q15.G
  Bottom 0.61: IC7.5 RN2.4
CH15
  Top 0.61: RN2.3 111.76,66.04 Q16.G
  Bottom 0.61: IC7.6 RN2.3
CH16
  Top 0.61: RN2.2 111.76,68.58 Q17.G
  Bottom 0.61: IC7.7 RN2.2
CTS
  Bottom 0.61: IC1.9 IC2.5
DQ
  Bottom 0.61: IC2.15 58.42,12.7 R38.1 U$2.2
DRVBASE
  Top 0.61: Q18.3 R14.2 T2.2 T1.2
GND  (via drill 0.4)
  Bottom 0.406: 15.24,41.91 C16.1
  Bottom 0.61: 32.38,52.7 34.29,50.8 IC1.15 C4.1 | 15.24,43.18 15.24,41.91
  Bottom 1.016: RN1.1 114.3,38.1 | RN2.1 114.3,68.58
  other vias: 106.68,10.16 93.98,10.16 86.36,10.16 45.72,7.62 103.19,36.83 105.09,17.14 30.48,63.5 33.02,60.96 35.56,60.96 30.48,78.74 33.02,81.28 35.56,81.28 15.24,55.88 12.7,43.18 5.08,35.56 7.62,12.7 7.62,17.78 60.96,63.5 73.66,68.58 48.26,73.66 63.5,86.36 50.8,76.2 60.96,88.9 73.66,63.5 106.68,78.74 68.58,62.23 63.5,63.5 55.88,55.88 53.34,55.88 149.86,78.74 144.78,73.66 139.7,78.74 101.6,76.2 97.47,78.74 111.76,91.44 121.92,91.44 96.52,91.44 5.08,81.28 22.86,81.28 45.72,27.94 35.56,33.02 25.4,27.94 25.4,20.32 109.22,43.18 71.12,50.8 71.12,55.88 76.2,25.4 71.12,25.4 71.12,30.48 46.99,31.11 46.99,33.66 149.86,73.66 101.6,10.16 71.12,45.72 48.26,78.74 43.18,78.74 55.88,68.58 44.45,86.04 38.73,84.77 27.94,83.82 102.23,55.24 102.87,66.67 104.14,44.13 83.82,46.67 103.82,28.89 39.37,73.66 43.18,71.12 40.64,58.42 40.64,60.96 58.42,81.28 73.66,73.66 68.58,81.28 63.5,81.28 93.98,71.12 12.7,35.56 31.75,41.91 31.75,50.8 55.88,50.8 125.09,86.04 45.72,21.59 45.72,24.13 45.72,19.05 45.72,16.51 45.72,13.97 45.72,44.45 22.86,33.02 31.75,38.1 17.78,63.5 25.4,63.5 17.78,78.74 5.08,25.4 12.7,25.4 140.97,15.24 140.97,22.86 140.97,30.48 140.97,38.1 140.97,45.72 140.97,53.34 140.97,60.96 140.97,68.58 139.7,73.66 106.68,83.82 127,78.74 73.66,48.26 78.74,25.4 73.66,25.4 89.85,79.38 93.66,23.5 121.92,9.84 121.92,17.46 121.92,25.08 121.92,32.7 121.92,40.32 121.92,47.87 121.92,55.56 121.92,63.18 119.38,70.8 31.43,29.21 38.73,48.58 120.33,6.67 130.49,6.67 140.65,6.67 99.06,43.5 137.16,91.44 149.86,83.82 134.62,76.2 123.19,78.42 58.42,86.36 60.96,73.66 83.5,74.3 76.52,70.17 96.52,71.12 99.06,71.12 101.6,71.12 104.14,71.12 106.68,71.12 71.44,82.23 73.98,72.07 90.49,73.98 94.93,76.2 81.6,78.11 86.36,87.63 81.28,84.45
  pour Bottom (isolate 0.406): 2.54,92.71 2.54,5.08 111.76,5.08 111.76,71.12 113.03,71.12 113.03,5.08 154.31,5.08 154.02,92.71
  pour Top (isolate 0.406): 2.54,5.08 2.54,92.71 154.31,92.71 154.31,5.08 113.03,5.08 113.03,71.12 111.76,71.12 111.76,5.08
KEY
  Bottom 0.61: IC2.27 KEY2.MP
MISO  (via drill 0.4 pad 1.27)
  Top 0.406: 60.96,53.34 60.96,58.42 SV2.9
  Top 0.61: 60.96,53.34 v60.96,20.32
  Bottom 0.406: R5.1 v60.96,20.32 IC2.18
MOSI  (via drill 0.4 pad 1.27)
  Top 0.406: 63.5,53.34 63.5,58.42 59.69,62.23 49.53,62.23 SV2.1
  Top 0.61: 63.5,53.34 v63.5,17.78
  Bottom 0.406: R6.1 v63.5,17.78 IC2.17
N$1
  Bottom 0.813: PWR_SW1.MP BATT_IN.MP
N$2
  Bottom 0.61: IC8.3 C25.1 35.56,73.66 C13.+ 40.64,76.2 45.72,71.12 D3.C
N$3  (via drill 0.4)
  Top 1.016: v68.58,68.58 66.04,71.12 Q18.2
  Bottom 0.61: IC2.6 44.45,33.02 46.99,35.56 46.99,41.91 48.26,43.18 48.26,50.8 50.8,53.34
  Bottom 1.016: R16.2 IC2.6 | 50.8,53.34 58.42,53.34 63.5,58.42 63.5,59.69 68.58,64.77 v68.58,68.58
N$4
  Bottom 1.016: R13.1 Q18.1
N$7
  Bottom 1.422: LSP_1.MP LSP_2.MP LSP_3.MP 129.54,73.66 | 129.54,73.66 LSP_4.MP | R_Z.1 129.54,73.66
N$8
  Top 1.27: R_Z.2 126.05,83.82 R_Z1.1 116.52,81.6 114.3,79.38
  Top 1.422: Q19.D 114.3,79.38
N$9
  Bottom 0.61: U$4.DIO2 81.28,55.88 78.74,58.42 R2.2
N$10
  Bottom 0.61: U$4.SCK R4.2
N$11  (via drill 0.4 pad 1.27)
  Top 0.61: R5.2 87.63,20.32 88.9,21.59 v88.9,45.72
  Bottom 0.61: v88.9,45.72 88.9,50.8 U$4.SDO
N$12
  Bottom 0.61: R6.2 82.55,17.78 81.28,19.05 U$4.SDI
N$13
  Bottom 0.406: U$4.NRES 73.66,51.75 74.61,50.8 R17.1
  Bottom 0.61: U$4.NRES 73.66,58.42 R3.1
N$17
  Bottom 0.61: IC2.21 C2.2
N$18
  Bottom 0.61: C9.2 33.02,22.86 Q1.1 43.18,22.99 IC2.10
N$19
  Bottom 0.406: C5.1 25.4,58.42 29.21,58.42 30.48,57.15 30.48,54.61 29.21,53.34 IC1.1
N$20
  Bottom 0.406: C5.2 22.86,48.26 IC1.3
N$21
  Bottom 0.406: C6.1 IC1.4
N$22
  Bottom 0.406: C6.2 IC1.5
N$23
  Bottom 0.61: IC2.9 35.56,25.4 | 35.56,25.4 Q1.2 35.56,27.94 | 35.56,25.4 C8.2
N$27
  Bottom 0.61: R9.2 40.64,15.24 IC2.13
N$28
  Bottom 0.61: R10.2 40.64,17.78 IC2.12
N$29
  Bottom 0.61: R11.2 40.64,20.32 IC2.11
N$30
  Bottom 0.61: LED_O.A R11.1
N$31
  Bottom 0.61: R8.2 40.64,12.7 IC2.14
N$32
  Bottom 0.61: R10.1 16.51,15.24 LED_R.A
N$33
  Bottom 0.61: LED_G.A 16.51,12.7 R9.1
N$34
  Bottom 0.61: LED_Y.A R8.1
N$37
  Bottom 0.61: IC2.28 50.8,48.9 R19.2 53.34,48.26 R18.1
N$43
  Bottom 0.406: C15.1 25.4,50.8 26.04,50.8 26.67,50.8 IC1.2
N$44
  Bottom 0.406: IC1.6 24.13,40.64 21.59,41.91 C16.2
N$51
  Top 0.406: 97.79,62.23 100.33,62.23
  Top 0.457: 97.16,62.23 97.79,62.23 | 100.33,62.23 100.97,62.23
  Top 0.508: 96.52,62.23 97.16,62.23 | 100.97,62.23 101.6,61.59
  Top 0.559: 95.25,62.23 96.52,62.23 | 101.6,61.59 101.6,60.96
  Top 0.61: IC7.14 100.33,55.88 101.6,57.15 101.6,60.96 | 95.25,62.23 93.98,63.5 R37.2
  Bottom 0.406: 97.79,52.07 100.33,52.07
  Bottom 0.457: 97.16,52.07 97.79,52.07 | 100.33,52.07 100.97,52.07
  Bottom 0.508: 100.97,52.07 101.6,51.44 | 96.52,52.07 97.16,52.07
  Bottom 0.559: 95.25,52.07 96.52,52.07
  Bottom 0.61: 95.25,52.07 91.44,55.88 R37.2 | 101.6,51.44 101.6,39.37 100.33,38.1 IC6.9
N$52
  Bottom 1.016: LSP1.MP R21.1 Q2.D
N$53
  Bottom 1.016: LSP2.MP R22.1 Q3.D
N$54
  Bottom 1.016: LSP3.MP R23.1 Q4.D
N$55
  Bottom 1.016: LSP4.MP R24.1 Q5.D
N$56
  Bottom 1.016: LSP5.MP R25.1 Q6.D
N$57
  Bottom 1.016: LSP6.MP R26.1 Q7.D
N$58
  Bottom 1.016: LSP7.MP R27.1 Q8.D
N$59
  Bottom 1.016: LSP8.MP R28.1 Q9.D
N$60
  Bottom 1.016: LSP9.MP R29.1 Q10.D
N$61
  Bottom 1.016: LSP10.MP R30.1 Q11.D
N$62
  Bottom 1.016: LSP11.MP R31.1 Q12.D
N$63
  Bottom 1.016: LSP12.MP R32.1 Q13.D
N$64
  Bottom 1.016: LSP13.MP R33.1 Q14.D
N$65
  Bottom 1.016: LSP14.MP R34.1 Q15.D
N$66
  Bottom 1.016: Q16.D R35.1 LSP15.MP
N$67
  Bottom 1.016: LSP16.MP R36.1 Q17.D
N$72
  Bottom 0.61: R21.2 LED1.A
N$73
  Bottom 0.61: R22.2 LED2.A
N$74
  Bottom 0.61: R23.2 LED3.A
N$75
  Bottom 0.61: LED4.A R24.2
N$76
  Bottom 0.61: LED5.A R25.2
N$77
  Bottom 0.61: LED6.A R26.2
N$78
  Bottom 0.61: LED7.A R27.2
N$79
  Bottom 0.61: R28.2 LED8.A
N$80
  Bottom 0.61: LED9.A R29.2
N$81
  Bottom 0.61: LED10.A R30.2
N$82
  Bottom 0.61: R31.2 LED11.A
N$83
  Bottom 0.61: LED12.A R32.2
N$84
  Bottom 0.61: LED13.A R33.2
N$85
  Bottom 0.61: LED14.A R34.2
N$86
  Bottom 0.61: LED15.A R35.2
N$87
  Bottom 0.61: LED16.A R36.2
NSEL
  Top 0.406: U$4.NSEL R17.2
  Bottom 0.61: IC2.16 R7.1 90.17,15.24 91.44,16.51 91.44,21.59 86.36,26.67 U$4.NSEL
PC_CTS_IN
  Bottom 0.406: X1.8 21.69,92.71 16.51,92.71 13.97,90.17 13.97,83.82 6.35,76.2 6.35,41.91 10.16,38.1 IC1.7
PC_RTS_OUT  (via drill 0.4)
  Top 0.406: v11.43,40.64 16.51,35.56 IC1.8
  Bottom 0.406: v11.43,40.64 7.62,44.45 7.62,76.2 15.24,83.82 15.24,89.92 17.14,91.83 19.83,91.83 X1.7
PC_RX_IN
  Bottom 0.406: X1.2 20.12,87.43 8.89,76.2 8.89,50.8 15.24,44.45 19.05,44.45 30.48,44.45 31.75,45.72 31.75,46.99 33.02,48.26 IC1.14
PC_TX_OUT  (via drill 0.4)
  Top 0.406: IC1.13 34.29,45.72 33.02,46.99 v15.24,46.99
  Bottom 0.406: v15.24,46.99 10.16,52.07 10.16,76.2 19.05,85.09 21.59,85.09 22.86,86.36 X1.3
PMOSG
  Bottom 1.27: Q19.G 93.98,73.66 90.17,77.47 T2.1 86.36,78.74 85.09,78.74 T1.1
RTS
  Bottom 0.61: IC1.10 IC2.4
RX
  Bottom 0.61: IC1.12 IC2.2
SCK  (via drill 0.4 pad 1.27)
  Top 0.406: 58.42,53.34 58.42,58.42 SV2.7
  Top 0.61: 58.42,53.34 v58.42,22.86
  Bottom 0.406: R4.1 v58.42,22.86 IC2.19
SHIFT_OE  (via drill 0.4 pad 1.27)
  Top 0.61: v96.52,30.48 R12.1 IC7.13
  Bottom 0.61: IC6.13 v96.52,30.48 91.44,35.56 IC2.24
SHIFT_RCK  (via drill 0.4 pad 1.27)
  Top 0.61: v93.98,35.56 93.98,59.69 95.25,60.96 IC7.12
  Bottom 0.61: IC6.12 v93.98,35.56 91.44,38.1 IC2.25
SHIFT_SCK  (via drill 0.4 pad 1.27)
  Top 0.61: IC7.11 102.87,63.5 104.14,62.23 104.14,49.53 106.68,46.99 106.68,43.18 104.14,40.64 v99.06,40.64
  Bottom 0.61: IC2.26 91.44,40.64 | IC6.11 91.44,40.64 | v99.06,40.64 91.44,40.64
SHIFT_SER
  Bottom 0.61: IC2.23 R20.1 91.44,33.02 IC6.14
TX
  Bottom 0.61: IC1.11 IC2.3
V_BATT
  Bottom 0.61: R18.2 71.12,60.96 71.12,68.58 68.58,71.12 58.42,71.12 55.88,73.66 55.88,78.74 53.34,81.28 49.15,81.28 47.88,82.55
  Bottom 1.016: D3.A PWR_SW2.MP 47.88,82.55 50.1,84.77 U$3.VIN

### Text on the board
bNames: El Fueradoro v2